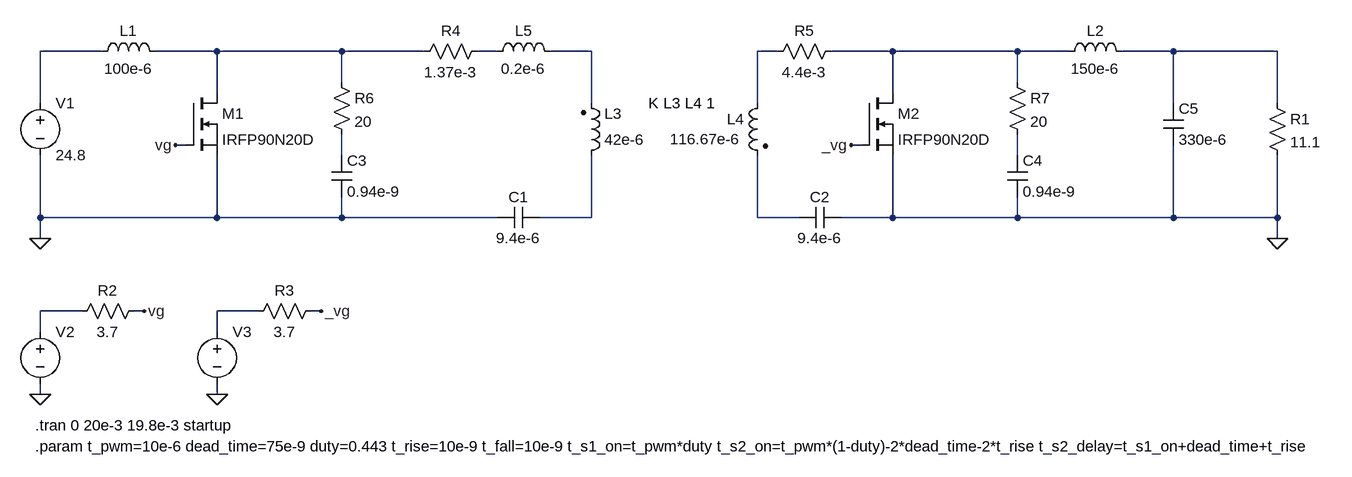
[diagram p0: schematic cuk-iso-prototype.asc]
cuk-iso-prototype.asc, the LTspice schematic file:
Version 4
SHEET 1 2248 680
WIRE -144 -240 -240 -240
WIRE 32 -240 -64 -240
WIRE 224 -240 32 -240
WIRE 352 -240 224 -240
WIRE 464 -240 432 -240
WIRE 608 -240 544 -240
WIRE 896 -240 864 -240
WIRE 1072 -240 976 -240
WIRE 1264 -240 1072 -240
WIRE 1344 -240 1264 -240
WIRE 1504 -240 1424 -240
WIRE 1664 -240 1504 -240
WIRE 224 -192 224 -240
WIRE 1264 -192 1264 -240
WIRE 32 -176 32 -240
WIRE 1072 -176 1072 -240
WIRE -240 -160 -240 -240
WIRE 608 -160 608 -240
WIRE 864 -160 864 -240
WIRE 1504 -160 1504 -240
WIRE 1664 -160 1664 -240
WIRE -16 -96 -32 -96
WIRE 1024 -96 1008 -96
WIRE 224 -80 224 -112
WIRE 1264 -80 1264 -112
WIRE -240 16 -240 -80
WIRE 32 16 32 -80
WIRE 32 16 -240 16
WIRE 224 16 224 -16
WIRE 224 16 32 16
WIRE 464 16 224 16
WIRE 608 16 608 -80
WIRE 608 16 528 16
WIRE 864 16 864 -80
WIRE 928 16 864 16
WIRE 1072 16 1072 -80
WIRE 1072 16 992 16
WIRE 1264 16 1264 -16
WIRE 1264 16 1072 16
WIRE 1504 16 1504 -96
WIRE 1504 16 1264 16
WIRE 1664 16 1664 -80
WIRE 1664 16 1504 16
WIRE -240 48 -240 16
WIRE 1664 48 1664 16
WIRE -176 160 -240 160
WIRE -80 160 -96 160
WIRE 96 160 32 160
WIRE 192 160 176 160
WIRE -240 192 -240 160
WIRE 32 192 32 160
WIRE -240 288 -240 272
WIRE 32 288 32 272
FLAG -240 48 0
FLAG -240 288 0
FLAG -80 160 vg
FLAG -32 -96 vg
FLAG 32 288 0
FLAG 192 160 _vg
FLAG 1008 -96 _vg
FLAG 1664 48 0
SYMBOL voltage -240 -176 R0
WINDOW 123 0 0 Left 0
WINDOW 39 0 0 Left 0
SYMATTR InstName V1
SYMATTR Value 24.8
SYMBOL cap 528 0 R90
WINDOW 0 0 32 VBottom 2
WINDOW 3 32 32 VTop 2
SYMATTR InstName C1
SYMATTR Value 9.4e-6
SYMATTR SpiceLine Rser=2.5e-3
SYMBOL res 1648 -176 R0
SYMATTR InstName R1
SYMATTR Value 11.1
SYMBOL nmos -16 -176 R0
SYMATTR InstName M1
SYMATTR Value IRFP90N20D
SYMBOL ind -160 -224 R270
WINDOW 0 32 56 VTop 2
WINDOW 3 5 56 VBottom 2
SYMATTR InstName L1
SYMATTR Value 100e-6
SYMATTR SpiceLine Rser=42.43e-3
SYMBOL res -80 144 R90
WINDOW 0 0 56 VBottom 2
WINDOW 3 32 56 VTop 2
SYMATTR InstName R2
SYMATTR Value 3.7
SYMBOL ind2 592 -64 M180
WINDOW 0 36 80 Left 2
WINDOW 3 36 40 Left 2
SYMATTR InstName L3
SYMATTR Value 42e-6
SYMATTR Type ind
SYMBOL ind2 880 -176 M0
WINDOW 3 41 71 Left 2
SYMATTR Value 116.67e-6
SYMATTR InstName L4
SYMATTR Type ind
SYMBOL res 192 144 R90
WINDOW 0 0 56 VBottom 2
WINDOW 3 32 56 VTop 2
SYMATTR InstName R3
SYMATTR Value 3.7
SYMBOL nmos 1024 -176 R0
SYMATTR InstName M2
SYMATTR Value IRFP90N20D
SYMBOL ind 1328 -224 R270
WINDOW 0 32 56 VTop 2
WINDOW 3 5 56 VBottom 2
SYMATTR InstName L2
SYMATTR Value 150e-6
SYMATTR SpiceLine Rser=10.26e-3
SYMBOL cap 1488 -160 R0
SYMATTR InstName C5
SYMATTR Value 330e-6
SYMATTR SpiceLine Rser=0.131
SYMBOL cap 992 0 R90
WINDOW 0 0 32 VBottom 2
WINDOW 3 32 32 VTop 2
SYMATTR InstName C2
SYMATTR Value 9.4e-6
SYMATTR SpiceLine Rser=2.5e-3
SYMBOL ind 448 -224 R270
WINDOW 0 32 56 VTop 2
WINDOW 3 5 56 VBottom 2
SYMATTR InstName L5
SYMATTR Value 0.2e-6
SYMATTR SpiceLine Rser=6.38e-3
SYMBOL res 448 -256 R90
WINDOW 0 0 56 VBottom 2
WINDOW 3 32 56 VTop 2
SYMATTR InstName R4
SYMATTR Value 1.37e-3
SYMBOL res 992 -256 R90
WINDOW 0 0 56 VBottom 2
WINDOW 3 32 56 VTop 2
SYMATTR InstName R5
SYMATTR Value 4.4e-3
SYMBOL res 208 -208 R0
SYMATTR InstName R6
SYMATTR Value 20
SYMBOL cap 208 -80 R0
SYMATTR InstName C3
SYMATTR Value 0.94e-9
SYMBOL res 1248 -208 R0
SYMATTR InstName R7
SYMATTR Value 20
SYMBOL cap 1248 -80 R0
SYMATTR InstName C4
SYMATTR Value 0.94e-9
SYMBOL voltage -240 176 R0
WINDOW 3 24 96 Invisible 2
WINDOW 123 0 0 Left 0
WINDOW 39 0 0 Left 0
SYMATTR Value PULSE(0 12 0 {t_rise} {t_fall} {t_s1_on} {t_pwm})
SYMATTR InstName V2
SYMBOL voltage 32 176 R0
WINDOW 3 24 96 Invisible 2
WINDOW 123 0 0 Left 0
WINDOW 39 0 0 Left 0
SYMATTR Value PULSE(0 12 {t_s2_delay} {t_rise} {t_fall} {t_s2_on} {t_pwm})
SYMATTR InstName V3
TEXT -248 336 Left 2 !.tran 0 20e-3 19.8e-3 startup
TEXT 696 -160 Left 2 !K L3 L4 1
TEXT -248 368 Left 2 !.param t_pwm=10e-6 dead_time=75e-9 duty=0.443 t_rise=10e-9 t_fall=10e-9 t_s1_on=t_pwm*duty t_s2_on=t_pwm*(1-duty)-2*dead_time-2*t_rise t_s2_delay=t_s1_on+dead_time+t_rise

The netlist it stands for:
* cuk-iso-prototype.asc
V1 N001 0 24.8
C1 N010 0 9.4e-6 Rser=2.5e-3
R1 N007 0 11.1
M1 N002 vg 0 0 IRFP90N20D
L1 N001 N002 100e-6 Rser=42.43e-3
R2 vg N012 3.7
L3 N010 N004 42e-6
L4 N005 N011 116.67e-6
R3 _vg N013 3.7
M2 N006 _vg 0 0 IRFP90N20D
L2 N006 N007 150e-6 Rser=10.26e-3
C5 N007 0 330e-6 Rser=0.131
C2 0 N011 9.4e-6 Rser=2.5e-3
L5 N003 N004 0.2e-6 Rser=6.38e-3
R4 N003 N002 1.37e-3
R5 N006 N005 4.4e-3
R6 N002 N008 20
C3 N008 0 0.94e-9
R7 N006 N009 20
C4 N009 0 0.94e-9
V2 N012 0 PULSE(0 12 0 {t_rise} {t_fall} {t_s1_on} {t_pwm})
V3 N013 0 PULSE(0 12 {t_s2_delay} {t_rise} {t_fall} {t_s2_on} {t_pwm})
.model NMOS NMOS
.model PMOS PMOS
.lib standard.mos
.tran 0 20e-3 19.8e-3 startup
K L3 L4 1
.param t_pwm=10e-6 dead_time=75e-9 duty=0.443 t_rise=10e-9 t_fall=10e-9 t_s1_on=t_pwm*duty t_s2_on=t_pwm*(1-duty)-2*dead_time-2*t_rise t_s2_delay=t_s1_on+dead_time+t_rise
.backanno
.end